# Altium schematic sheet RTM_CON.SchDoc
size A3; DocumentNumber: 21; SheetNumber: 21; SheetTotal: 30
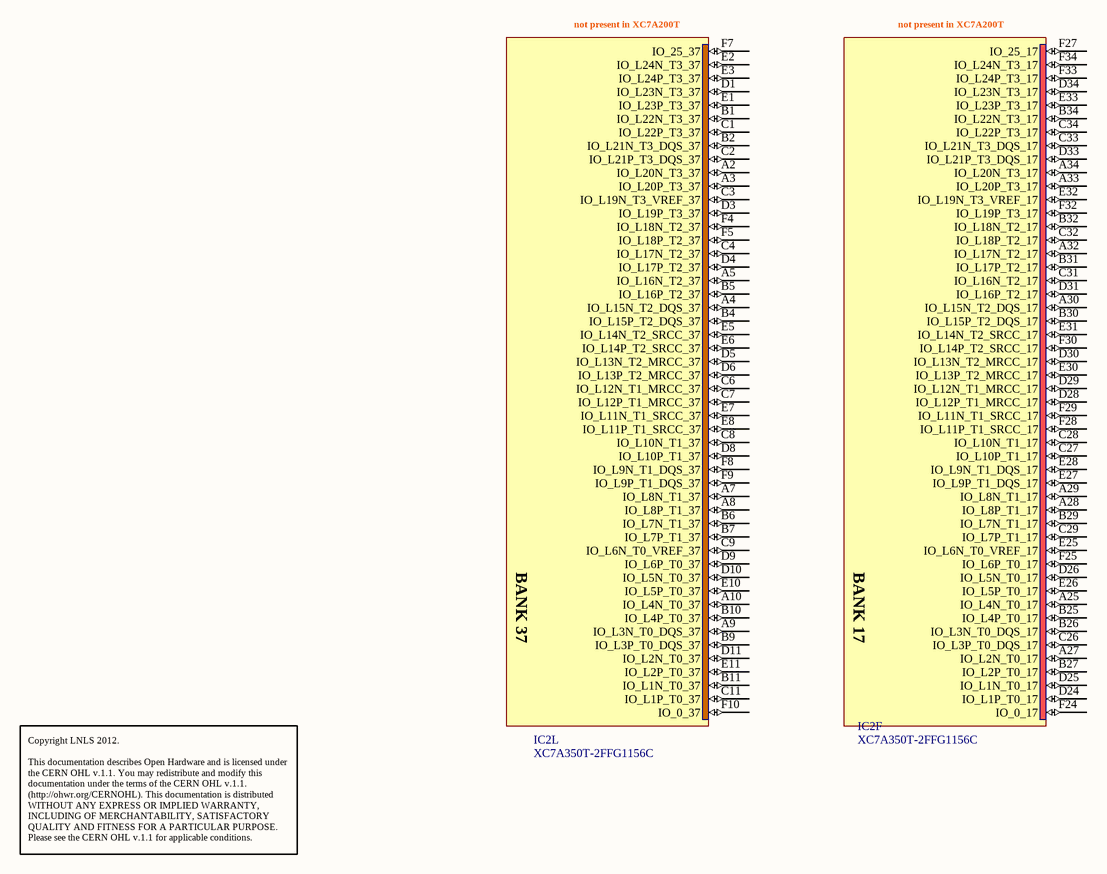
[diagram p0: RTM_CON.SchDoc]

## Parts
IC2  XC7A350T-2FFG1156C  [BGA1156C100P34X34_3500X3500X335]  (parts F,L of 23)

## Nets

Not connected (* = marked no-connect by the designer): IC2 A2(IO_L20N_T3_37) A3(IO_L20P_T3_37) A4(IO_L15N_T2_DQS_37) A5(IO_L16N_T2_37) A7(IO_L8N_T1_37) A8(IO_L8P_T1_37) A9(IO_L3N_T0_DQS_37) A10(IO_L4N_T0_37) A25(IO_L4N_T0_17) A27(IO_L2N_T0_17) A28(IO_L8P_T1_17) A29(IO_L8N_T1_17) A30(IO_L15N_T2_DQS_17) A32(IO_L17N_T2_17) A33(IO_L20P_T3_17) A34(IO_L20N_T3_17) B1(IO_L22N_T3_37) B2(IO_L21N_T3_DQS_37) B4(IO_L15P_T2_DQS_37) B5(IO_L16P_T2_37) B6(IO_L7N_T1_37) B7(IO_L7P_T1_37) B9(IO_L3P_T0_DQS_37) B10(IO_L4P_T0_37) B11(IO_L1N_T0_37) B25(IO_L4P_T0_17) B26(IO_L3N_T0_DQS_17) B27(IO_L2P_T0_17) B29(IO_L7N_T1_17) B30(IO_L15P_T2_DQS_17) B31(IO_L17P_T2_17) B32(IO_L18N_T2_17) B34(IO_L22N_T3_17) C1(IO_L22P_T3_37) C2(IO_L21P_T3_DQS_37) C3(IO_L19N_T3_VREF_37) C4(IO_L17N_T2_37) C6(IO_L12N_T1_MRCC_37) C7(IO_L12P_T1_MRCC_37) C8(IO_L10N_T1_37) C9(IO_L6N_T0_VREF_37) C11(IO_L1P_T0_37) C26(IO_L3P_T0_DQS_17) C27(IO_L10P_T1_17) C28(IO_L10N_T1_17) C29(IO_L7P_T1_17) C31(IO_L16N_T2_17) C32(IO_L18P_T2_17) C33(IO_L21N_T3_DQS_17) C34(IO_L22P_T3_17) D1(IO_L23N_T3_37) D3(IO_L19P_T3_37) D4(IO_L17P_T2_37) D5(IO_L13N_T2_MRCC_37) D6(IO_L13P_T2_MRCC_37) D8(IO_L10P_T1_37) D9(IO_L6P_T0_37) D10(IO_L5N_T0_37) D11(IO_L2N_T0_37) D24(IO_L1P_T0_17) D25(IO_L1N_T0_17) D26(IO_L5N_T0_17) D28(IO_L12P_T1_MRCC_17) D29(IO_L12N_T1_MRCC_17) D30(IO_L13N_T2_MRCC_17) D31(IO_L16P_T2_17) D33(IO_L21P_T3_DQS_17) D34(IO_L23N_T3_17) E1(IO_L23P_T3_37) E2(IO_L24N_T3_37) E3(IO_L24P_T3_37) E5(IO_L14N_T2_SRCC_37) E6(IO_L14P_T2_SRCC_37) E7(IO_L11N_T1_SRCC_37) E8(IO_L11P_T1_SRCC_37) E10(IO_L5P_T0_37) E11(IO_L2P_T0_37) E25(IO_L6N_T0_VREF_17) E26(IO_L5P_T0_17) E27(IO_L9P_T1_DQS_17) E28(IO_L9N_T1_DQS_17) E30(IO_L13P_T2_MRCC_17) E31(IO_L14N_T2_SRCC_17) E32(IO_L19N_T3_VREF_17) E33(IO_L23P_T3_17) F4(IO_L18N_T2_37) F5(IO_L18P_T2_37) F7(IO_25_37) F8(IO_L9N_T1_DQS_37) F9(IO_L9P_T1_DQS_37) F10(IO_0_37) F24(IO_0_17) F25(IO_L6P_T0_17) F27(IO_25_17) F28(IO_L11P_T1_SRCC_17) F29(IO_L11N_T1_SRCC_17) F30(IO_L14P_T2_SRCC_17) F32(IO_L19P_T3_17) F33(IO_L24P_T3_17) F34(IO_L24N_T3_17)

## Notes on the sheet
- (near IC2) not present in XC7A200T
- Copyright LNLS 2012.
  This documentation describes Open Hardware and is licensed under the CERN OHL v.1.1. You may redistribute and modify this documentation under the terms of the CERN OHL v.1.1. (http://ohwr.org/CERNOHL). This documentation is distributed WITHOUT ANY EXPRESS OR IMPLIED WARRANTY, INCLUDING OF MERCHANTABILITY, SATISFACTORY QUALITY AND FITNESS FOR A PARTICULAR PURPOSE. Please see the CERN OHL v.1.1 for applicable conditions.
- (in symbol XC7A350T-2FFG1156C, part F) BANK 17
- (in symbol XC7A350T-2FFG1156C, part L) BANK 37

## Library data of the parts
IC2 = XC7A350T-2FFG1156C: Artix-6 FPGA, 16 GTPs, 600 User I/Os, 1156-Pin BGA, Speed Grade 2, Commercial Grade, Pb-Free; Part Description: Artix-7 FPGA, 16 GTPs, 600 User I/Os, 1156-Pin BGA, Speed Grade 2, Commercial Grade, Pb-Free; Manufacturer: XILINX; Table: Logic; Part Number: XC7A350T-2FFG1156C; Component Kind: Standard; Component Type: Standard; Device: XC7A350T-2FFG1156C; PackageDescription: BGA, 1.00mm Pitch, Square; 1156 Pin, 34 Columns X 34 Rows, 35.00mm X 35.00mm X 3.350mm H; Manufacturer Part Number: XC7A350T-2FFG1156C; Pin Count: 1156; Case: BGA1156; Mounted: Yes; Socket: No; SMD: Yes; ComponentHeight: 3.35mm; HelpURL: \\cern.ch\dfs\Applications\Altium\Datasheets\XC7A350T-2FFG1156C.pdf; ComponentLink1URL: \\cern.ch\dfs\Applications\Altium\Datasheets\XC7A350T-2FFG1156C.pdf; ComponentLink1Description: Package/Pinout; Author: CERN DEM JLC; CreateDate: 2012-09-19; LatestRevisionDate: 2012-09-19